# Altium project Cats_and_Dogs_Schematics_ESE516.PrjPcb (part 2 of 3)

## Sheet MCU.SchDoc: Smart Street Light System - MCU Schematic Doc
size 431 x 279 mm; Author: Arvind Balaji Narayan, Gopik Anand; Engineer: Arvind Balaji Narayan, Gopik Anand; Organization: University of Pennsylvania
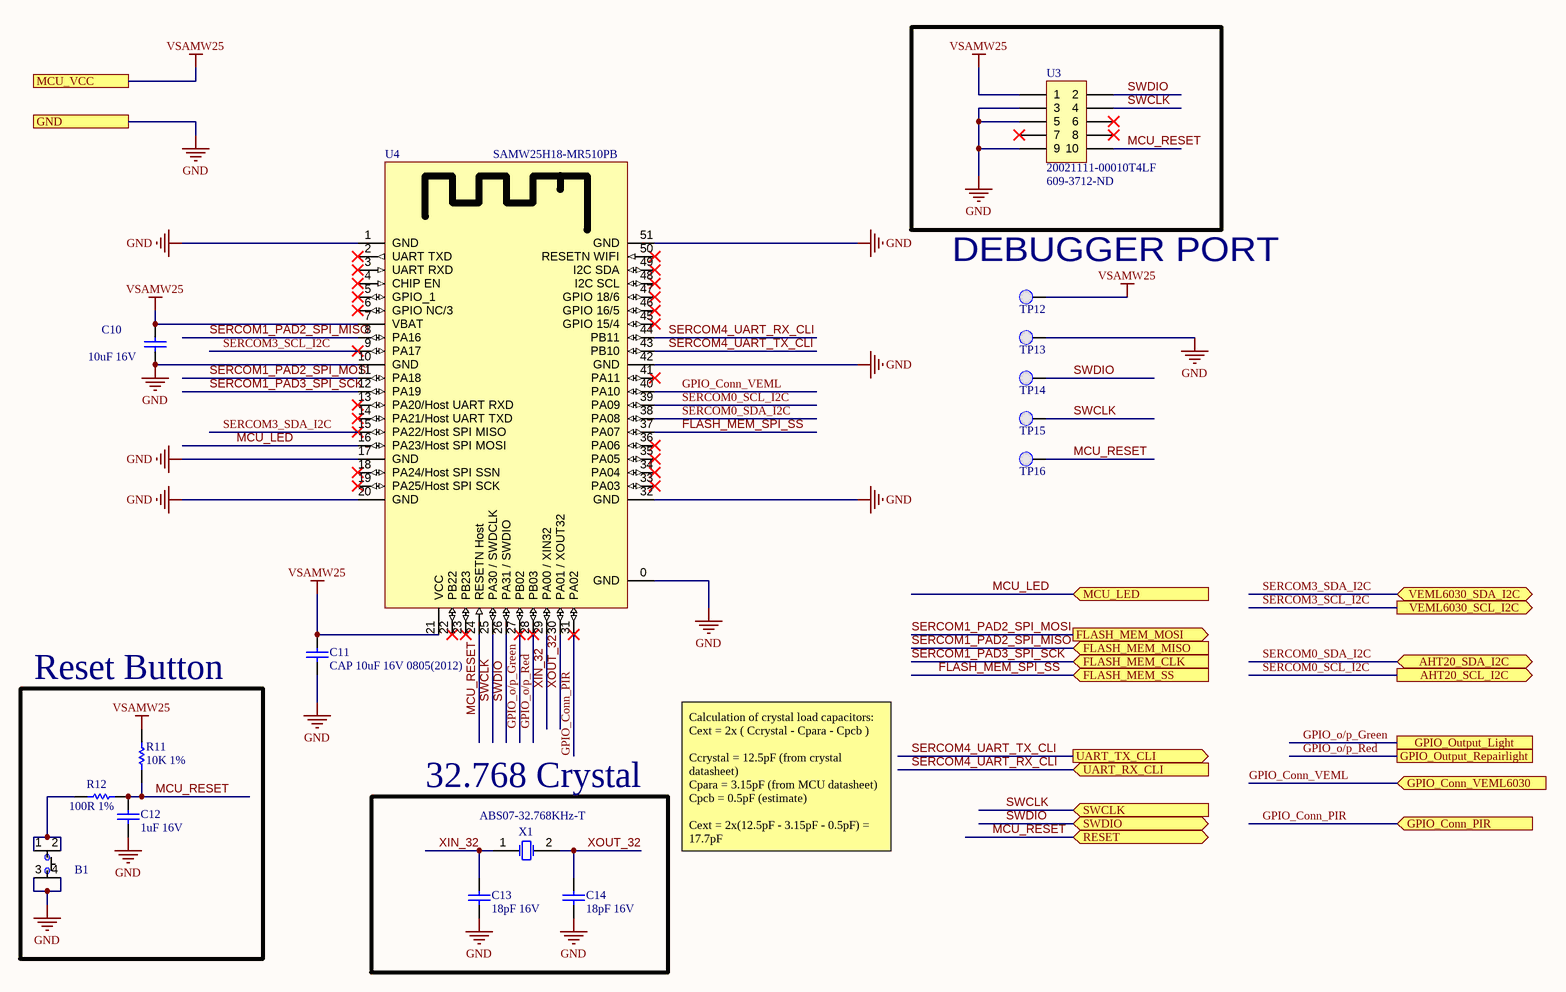
[diagram p5: MCU.SchDoc]

### Parts
B1  PTS810 SJK 250 SMTR LFS  [PTS810 SJK 250 SMTR LFS]  (value not drawn)
C10  10uF 16V  [CAPC0805(2012)145_N]
C11  CAP 10uF 16V 0805(2012)  [CAPC0805(2012)145_N]
C12  1uF 16V  [CAPC0603(1608)100_N]
C13  18pF 16V  [CAPC0603(1608)100_N]
C14  18pF 16V  [CAPC0603(1608)100_N]
R11  10K 1%  [RESC0603(1608)_N]
R12  100R 1%  [RESC0603(1608)_N]
TP12  0.1" Pad  [PCBComponent]  (value not drawn)  (no BOM)
TP13  0.1" Pad  [PCBComponent]  (value not drawn)  (no BOM)
TP14  0.1" Pad  [PCBComponent]  (value not drawn)  (no BOM)
TP15  0.1" Pad  [PCBComponent]  (value not drawn)  (no BOM)
TP16  0.1" Pad  [PCBComponent]  (value not drawn)  (no BOM)
U3  20021111-00010T4LF  Supplier Part Number 1: 609-3712-ND  [20021111-00010T4LF]
U4  SAMW25H18-MR510PB  [SAMW25H18-MR510PB]
X1  ABS07-32.768KHz-T  [ABRA-ABS07-2_V]

### Blocks framed on the sheet
Reset Button: B1 C12 R11 R12
32.768 Crystal: C13 C14 X1

### Ports
AHT20_SCL_I2C (out), AHT20_SDA_I2C (bidir), FLASH_MEM_CLK (in), FLASH_MEM_MISO (in), FLASH_MEM_MOSI (out), FLASH_MEM_SS (in), GND, GPIO_Conn_PIR (in), GPIO_Conn_VEML6030 (in), GPIO_Output_Light, GPIO_Output_Repairlight, MCU_LED (in), MCU_VCC, RESET (bidir), SWCLK (in), SWDIO (bidir), UART_RX_CLI (in), UART_TX_CLI (out), VEML6030_SCL_I2C (out), VEML6030_SDA_I2C (bidir)

### Nets
GND: B1.3 B1.4 C10.1 C11.1 C12.1 C13.1 C14.1 TP13.1(PAD) U3.3 U3.5 U3.9 U4.0(GND) U4.1(GND) U4.10(GND) U4.17(GND) U4.20(GND) U4.32(GND) U4.42(GND) U4.51(GND) ; port GND
VSAMW25: C10.2 C11.2 R11.2 TP12.1(PAD) U3.1 U4.7(VBAT) U4.21(VCC) ; port MCU_VCC  [project net 3.3V]
FLASH_MEM_SPI_SS: U4.37(PA07) ; port FLASH_MEM_SS
GPIO_Conn_PIR: U4.31(PA02) ; port GPIO_Conn_PIR
GPIO_Conn_VEML: U4.40(PA10) ; port GPIO_Conn_VEML6030  [project net GPIO_Conn_MCU]
GPIO_o/p_Green: U4.27(PB02) ; port GPIO_Output_Light
GPIO_o/p_Red: U4.28(PB03) ; port GPIO_Output_Repairlight
MCU_LED: U4.16(PA23/Host_SPI_MOSI) ; port MCU_LED
MCU_RESET: C12.2 R11.1 R12.2 TP16.1(PAD) U3.10 U4.24(RESETN_Host) ; port RESET
SERCOM0_SCL_I2C: U4.39(PA09) ; port AHT20_SCL_I2C  [project net SCL_AHT20]
SERCOM0_SDA_I2C: U4.38(PA08) ; port AHT20_SDA_I2C  [project net SDA_AHT20]
SERCOM1_PAD2_SPI_MISO: U4.8(PA16) ; port FLASH_MEM_MISO
SERCOM1_PAD2_SPI_MOSI: U4.11(PA18) ; port FLASH_MEM_MOSI
SERCOM1_PAD3_SPI_SCK: U4.12(PA19) ; port FLASH_MEM_CLK
SERCOM3_SCL_I2C: U4.9(PA17) ; port VEML6030_SCL_I2C  [project net SCL_VEML6030]
SERCOM3_SDA_I2C: U4.15(PA22/Host_SPI_MISO) ; port VEML6030_SDA_I2C  [project net SDA_VEML6030]
SERCOM4_UART_RX_CLI: U4.44(PB11) ; port UART_RX_CLI  [project net MCU_RX_UART_CLI]
SERCOM4_UART_TX_CLI: U4.43(PB10) ; port UART_TX_CLI  [project net MCU_TX_UART_CLI]
SWCLK: TP15.1(PAD) U3.4 U4.25(PA30_/_SWDCLK) ; port SWCLK
SWDIO: TP14.1(PAD) U3.2 U4.26(PA31_/_SWDIO) ; port SWDIO
XIN_32: C13.2 U4.29(PA00_/_XIN32) X1.1(X1)
XOUT_32: C14.2 U4.30(PA01_/_XOUT32) X1.2(X2)
NetB1_1: B1.1 B1.2 R12.1

Not connected (* = marked no-connect by the designer): U3 6* 7* 8*; U4 2(UART_TXD)* 3(UART_RXD)* 4(CHIP_EN)* 5(GPIO_1)* 6(GPIO_NC/3)* 13(PA20/Host_UART_RXD)* 14(PA21/Host_UART_TXD)* 18(PA24/Host_SPI_SSN)* 19(PA25/Host_SPI_SCK)* 22(PB22)* 23(PB23)* 33(PA03)* 34(PA04)* 35(PA05)* 36(PA06)* 41(PA11)* 45(GPIO_15/4)* 46(GPIO_16/5)* 47(GPIO_18/6)* 48(I2C_SCL)* 49(I2C_SDA)* 50(RESETN_WIFI)*

### Notes on the sheet
- (near TP12) DEBUGGER PORT
- Calculation of crystal load capacitors:
  Cext = 2x ( Ccrystal - Cpara - Cpcb )
  Ccrystal = 12.5pF (from crystal datasheet)
  Cpara = 3.15pF (from MCU datasheet)
  Cpcb = 0.5pF (estimate)
  Cext = 2x(12.5pF - 3.15pF - 0.5pF) = 17.7pF
- DWG. NO.
- REV.
- SHT.
- THIS DOCUMENT AND THE DATA DISCLOSED HEREIN OR HEREWITH IS THE PROPERTY OF ALTIUM LIMITED AND MAY BE FREELY DISTRIBUTED IN WHOLE. NO RIGHTS ARE RESERVED OR EXPRESS OR IMPLIED WARANTEE GIVEN.
- REVISION
- DESCRIPTION
- DATE
- APPROVED
- ENG:
- APPROVALS
- PROJECT
- DSN:
- CHK:
- REFERENCE DOCUMENTS
- PROJECT REVISION:
- TITLE
- DOCUMENT REVISION:
- DESIGN ITEM:
- BOM:
- FAB DWG:
- PCB DWG:
- ASSY DWG:
- SCALE:
- SIZE
- B
- CAGE CODE
- FILE NAME
- DWG NO.
- SHEET
- OF
- REV

### Library data of the parts
B1 = PTS810 SJK 250 SMTR LFS: SWITCH TACTILE SPST-NO 0.05A 16V Tactile Switch SPST-NO Top Actuated Surface Mount; Manufacturer: ITT /  C&K Components; Part # Aliases: Y97LT25B5DBFP; Operating Force: 2.6 N; Actuator: Oval; Current Rating: 50 mA; Voltage Rating DC: 16 VDC; Contact Form: SPST; Switch Function: OFF - (ON); Mounting Direction: Straight; Stem Height: 2.5 mm; Brand: C&K Components; Travel: 0.15 mm; Manufacturer Part Number: PTS810SJK250SMTRLFS; Product Category: Tactile Switches; RoHS: Details; Termination Style: J Form Lead; Mounting Style: SMD/SMT; Color: White; Packaging: Reel; Contact Plating: Silver; Operating Temperature Range: - 40 C to + 85 C; Series: PTS810; Factory Pack Quantity: 2900; ComponentLink1URL: https://datasheet.ciiva.com/18514/pts810-4mar13-18514061.pdf; ComponentLink1Description: https://datasheet.ciiva.com/18514/pts810-4mar13-18514061.pdf; ComponentLink2URL: https://datasheet.ciiva.com/18514/pts810-4mar13-18514062.pdf; ComponentLink2Description: https://datasheet.ciiva.com/18514/pts810-4mar13-18514062.pdf; ComponentLink3URL: https://datasheet.ciiva.com/18514/pts810-4mar13-18514063.pdf; ComponentLink3Description: https://datasheet.ciiva.com/18514/pts810-4mar13-18514063.pdf; Supplier 1: Digi-Key; Supplier Part Number 1: CKN10503CT-ND
C10 C11 = CMP-1036-04927-1: CAP 10uF 16V ±10% 0805 (2012 Metric) Thickness 1.45mm SMD; Case-EIA: 0805; Tolerance: Â±10%; Case-Metric: 2012; Rated Voltage: 16 V; Technology: SMT; Value: 10uF; Max Thickness: 1.45 mm
C12 = CMP-1035-02736-1: CAP 1uF 16V ±5% 0603 (1608 Metric) Thickness 1mm SMD; Case-Metric: 1608; Case-EIA: 0603; Tolerance: Â±5%; Technology: SMT; Max Thickness: 1 mm; Rated Voltage: 16 V; Value: 1uF
C13 C14 = CMP-1035-00738-1: CAP 18pF 16V ±5% 0603 (1608 Metric) Thickness 1mm SMD; Tolerance: Â±5%; Case-EIA: 0603; Case-Metric: 1608; Max Thickness: 1 mm; Rated Voltage: 16 V; Value: 18pF; Technology: SMT
R11 = CMP-1012-00623-1: 10K 0.1W 1% 0603 (1608 Metric)  SMD; Value: 10000.00 Ohm; Case-EIA: 0603; Case-Metric: 1608; Power: 0.1 W; Tolerance: 1 %; Technology: SMT
R12 = CMP-1012-00397-1: 100R 0.1W 1% 0603 (1608 Metric)  SMD; Value: 100.00 Ohm; Case-EIA: 0603; Case-Metric: 1608; Technology: SMT; Tolerance: 1 %; Power: 0.1 W
TP12-TP16 = 0.1" Pad-A.4
U3 = 20021111-00010T4LF: CONN HEADER 10POS UNSHD VERT T/H; Manufacturer: Amphenol / FCI; Stack Height: 2.5 mm; Number of Positions / Contacts: 10; Brand: FCI; Pitch: 1.27 mm; Mounting Angle: Vertical; Current Rating: 10 A; Mating Post Length: 3.05 mm; Voltage Rating: 125 V; Manufacturer Part Number: 20021111-00010T4LF; Mounting Style: Through Hole; Product Category: Headers & Wire Housings; RoHS: Details; Series: Minitek; Product Type: Headers; Type: Unshrouded; Number of Positions: 10; Number of Rows: 2; Contact Plating: Gold; Housing Material: Plastic; Termination Style: Through Hole; Contact Material: Nickel; Packaging: Tube; Factory Pack Quantity: 93; Termination Post Length: 2.3 mm; ComponentLink1URL: https://datasheet.ciiva.com/1433/1079612-1433267.pdf; ComponentLink1Description: https://datasheet.ciiva.com/1433/1079612-1433267.pdf; ComponentLink2URL: https://datasheet.ciiva.com/409/20021111-409158.pdf; ComponentLink2Description: https://datasheet.ciiva.com/409/20021111-409158.pdf; ComponentLink3URL: https://datasheet.ciiva.com/5131/20021111-5131386.pdf; ComponentLink3Description: https://datasheet.ciiva.com/5131/20021111-5131386.pdf; ComponentLink4URL: https://datasheet.ciiva.com/9465/20021111-9465402.pdf; ComponentLink4Description: https://datasheet.ciiva.com/9465/20021111-9465402.pdf; Supplier 1: Digi-Key
U4 = SAMW25H18-MR510PB: RF TXRX MODULE WIFI TRACE ANT; Manufacturer: Atmel; Manufacturer Part Number: ATSAMW25H18-MR510PB; Protocol: 802.11b/g/n; Frequency: 2.4GHz; Data Rate: 65Mbps; Power - Output: 17dBm; Sensitivity: -95.5dBm; Serial Interfaces: SPI, UART; Antenna Type: Integrated, Trace; Memory Size: 256kB Flash, 32kB SRAM; Voltage - Supply: 2.7 V ~ 4.2 V; Category: RF/IF and RFID; Family: RF Transceiver Modules; Series: Xplained Pro; Packaging: Tray; RF Family/Standard: WiFi; Modulation: -; Current - Receiving: -; Current - Transmitting: -; Mounting Type: Surface Mount; Operating Temperature: -40°C ~ 85°C; Package / Case: Module; ComponentLink1URL: http://www.atmel.com/devices/ATSAMW25.aspx; ComponentLink1Description: http://www.atmel.com/devices/ATSAMW25.aspx; ComponentLink2URL: http://www.farnell.com/datasheets/1965115.pdf; ComponentLink2Description: http://www.farnell.com/datasheets/1965115.pdf; Supplier 1: Digikey; Stock 1: 120; Pricing 1: 1=19.14 (USD); Supplier Part Number 1: ATSAMW25H18-MR510PB-ND
X1 = CMP-0447-00001-2: Crystal, 32.768 kHz, 12.5 pF, -40 to 85 degC, SMD Low Profile 3.2 x 1.5 x 0.9 mm, Tape and Reel; Manufacturer: Abracon; Q Value (Type): 30000; Operation Mode: Flexural Mode (Tuning Fork); Shunt Capacitance (C0): 0.9 to 1.2 pF; Load Capacitance (CL): 12.5 pF; Frequency Tolerance @+25degC: +/- 20 ppm; Drive Level (Type): 0.1 uW; Equivalent Series Resistance (R1): 70 Kohm; Insulation Resistance (Min): 500 Mohm; ComponentLink3URL: http://www.abracon.com/Resonators/ABS07.pdf; PackageDescription: 2-Pin Hand Drawn, Body 3.2x1.5mm, Pitch 2.5mm; Operating Temperature: -40 to 85 degC; ComponentLink2URL: http://www.abracon.com/Resonators/ABS07.pdf; PackageReference: ABS07-2; ComponentLink3Description: Package Specification; ComponentLink1Description: Manufacturer URL; DatasheetVersion: 04.03.13; Mounting Technology: Surface Mount; ComponentLink2Description: Datasheet; ComponentLink1URL: http://www.abracon.com/; PartNumber: ABS07-32.768KHz-T; Packing: Tape and Reel; Frequency: 32.768 kHz

## Sheet Sensors_StreetLight.SchDoc: Smart Street Light System - Street Light Schematic Doc
size 431 x 279 mm; Author: Arvind Balaji Narayan, Gopik Anand; CompanyName: Cats_and_Dogs; Engineer: Arvind Balaji Narayan, Gopik Anand; Organization: University of Pennsylvania
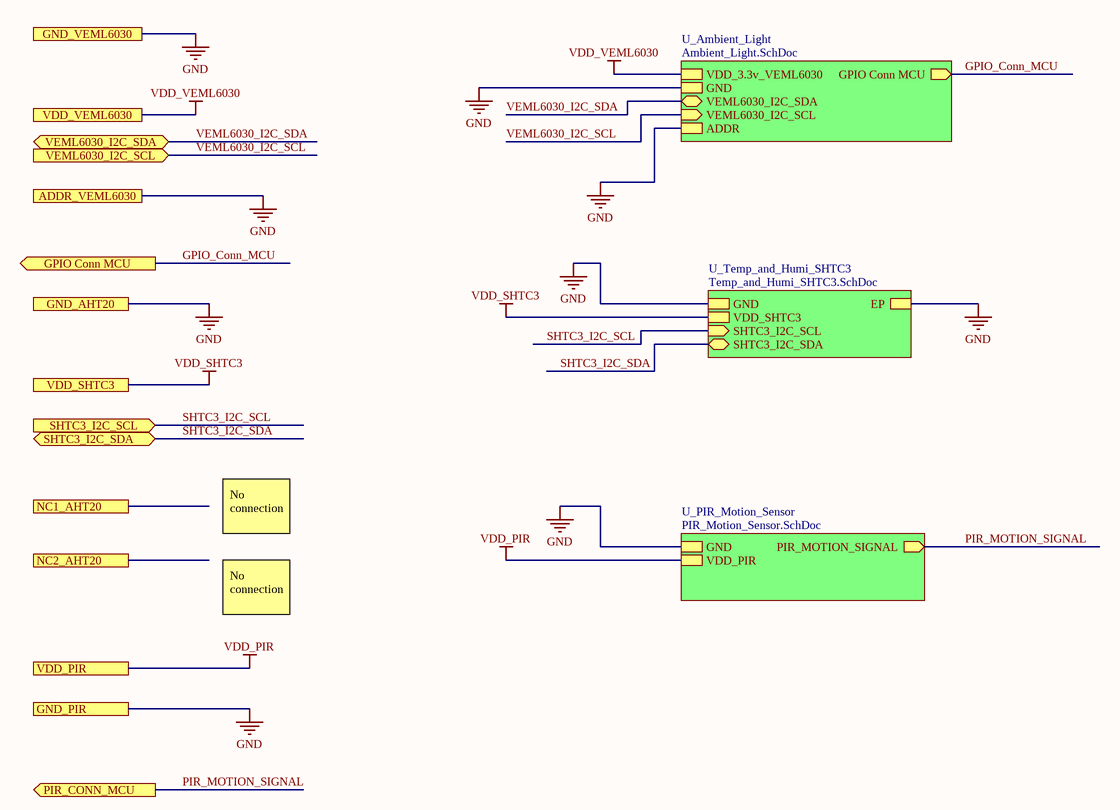
[diagram p6: Sensors_StreetLight.SchDoc]

### Sub-sheets
U_Ambient_Light = Ambient_Light.SchDoc: VDD_3.3v_VEML6030, GND, VEML6030_I2C_SDA (bidir), VEML6030_I2C_SCL (in), ADDR, GPIO Conn MCU (out)
U_PIR_Motion_Sensor = PIR_Motion_Sensor.SchDoc: GND, VDD_PIR, PIR_MOTION_SIGNAL (out)
U_Temp_and_Humi_SHTC3 = Temp_and_Humi_SHTC3.SchDoc: GND, VDD_SHTC3, SHTC3_I2C_SCL (in), SHTC3_I2C_SDA (bidir), EP

### Ports
ADDR_VEML6030, GND_AHT20, GND_PIR, GND_VEML6030, GPIO Conn MCU (out), NC1_AHT20, NC2_AHT20, PIR_CONN_MCU (out), SHTC3_I2C_SCL (in), SHTC3_I2C_SDA (bidir), VDD_PIR, VDD_SHTC3, VDD_VEML6030, VEML6030_I2C_SCL (in), VEML6030_I2C_SDA (bidir)

### Nets
GND: port ADDR_VEML6030, port GND_AHT20, port GND_VEML6030, port GND_PIR, sheet U_Ambient_Light/GND, sheet U_Ambient_Light/ADDR, sheet U_PIR_Motion_Sensor/GND, sheet U_Temp_and_Humi_SHTC3/GND, sheet U_Temp_and_Humi_SHTC3/EP
VDD_PIR: port VDD_PIR, sheet U_PIR_Motion_Sensor/VDD_PIR  [project net 12V]
VDD_SHTC3: port VDD_SHTC3, port VDD_VEML6030, sheet U_Ambient_Light/VDD_3.3v_VEML6030, sheet U_Temp_and_Humi_SHTC3/VDD_SHTC3  [also labelled VDD_VEML6030]  [project net 3.3V]
GPIO_Conn_MCU: port GPIO Conn MCU, sheet U_Ambient_Light/GPIO Conn MCU
PIR_MOTION_SIGNAL: port PIR_CONN_MCU, sheet U_PIR_Motion_Sensor/PIR_MOTION_SIGNAL  [project net GPIO_Conn_PIR]
SHTC3_I2C_SCL: port SHTC3_I2C_SCL, sheet U_Temp_and_Humi_SHTC3/SHTC3_I2C_SCL  [project net SCL_AHT20]
SHTC3_I2C_SDA: port SHTC3_I2C_SDA, sheet U_Temp_and_Humi_SHTC3/SHTC3_I2C_SDA  [project net SDA_AHT20]
VEML6030_I2C_SCL: port VEML6030_I2C_SCL, sheet U_Ambient_Light/VEML6030_I2C_SCL  [project net SCL_VEML6030]
VEML6030_I2C_SDA: port VEML6030_I2C_SDA, sheet U_Ambient_Light/VEML6030_I2C_SDA  [project net SDA_VEML6030]

### Notes on the sheet
- No connection
- DWG. NO.
- REV.
- SHT.
- THIS DOCUMENT AND THE DATA DISCLOSED HEREIN OR HEREWITH IS THE PROPERTY OF ALTIUM LIMITED AND MAY BE FREELY DISTRIBUTED IN WHOLE. NO RIGHTS ARE RESERVED OR EXPRESS OR IMPLIED WARANTEE GIVEN.
- REVISION
- DESCRIPTION
- DATE
- APPROVED
- ENG:
- APPROVALS
- PROJECT
- DSN:
- CHK:
- REFERENCE DOCUMENTS
- PROJECT REVISION:
- TITLE
- DOCUMENT REVISION:
- DESIGN ITEM:
- BOM:
- FAB DWG:
- PCB DWG:
- ASSY DWG:
- SCALE:
- SIZE
- B
- CAGE CODE
- FILE NAME
- DWG NO.
- SHEET
- OF
- REV

## Sheet Ambient_Light.SchDoc: Smart Street Light System - Light Sensor Schematic Doc
size 431 x 279 mm; Author: Arvind Balaji Narayan, Gopik Anand; CompanyName: Cats_and_Dogs; Engineer: Arvind Balaji Narayan, Gopik Anand; Organization: University of Pennsylvania
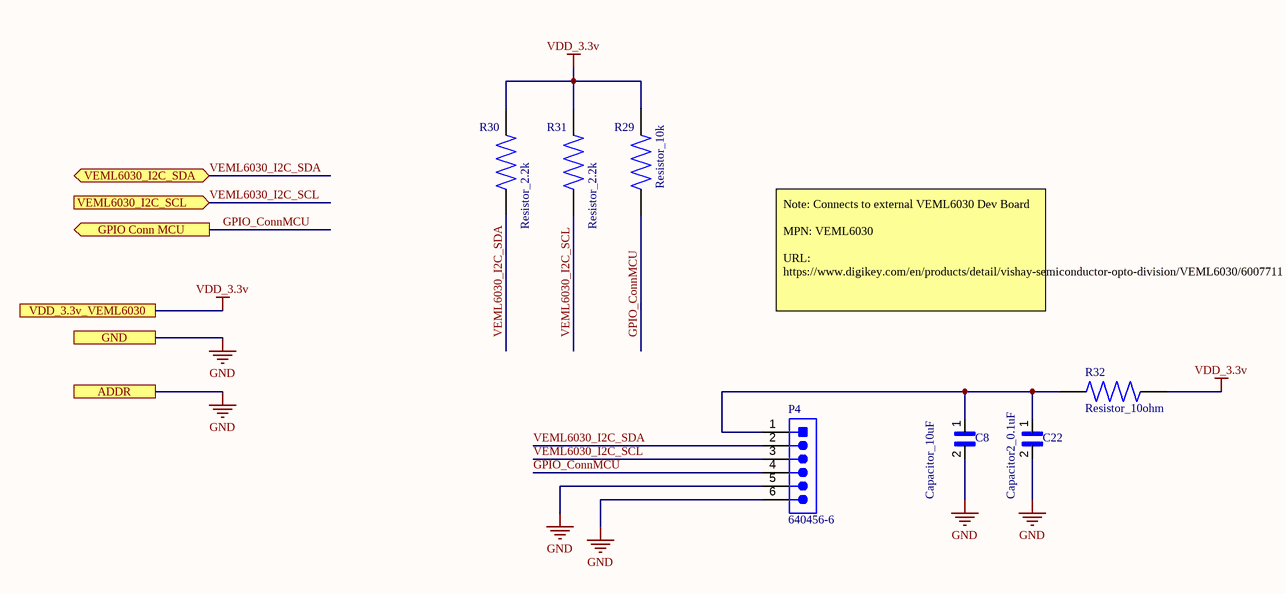
[diagram p7: Ambient_Light.SchDoc]

### Parts
C8  Capacitor_10uF  [Capacitor_10uF]
C22  Capacitor2_0.1uF  [Capacitor2_0.1uF]
P4  640456-6  [TECO-640456-6_V]
R29  Resistor_10k  [Resistor_10k]
R30  Resistor_2.2k  [Resistor_2.2k]
R31  Resistor_2.2k  [Resistor_2.2k]
R32  Resistor_10ohm  [Resistor_10ohm]

### Ports
ADDR, GND, GPIO Conn MCU (out), VDD_3.3v_VEML6030, VEML6030_I2C_SCL (in), VEML6030_I2C_SDA (bidir)

### Nets
GND: C8.2 C22.2 P4.5 P4.6 ; port GND, port ADDR
VDD_3.3v: R29.2 R30.2 R31.2 R32.2 ; port VDD_3.3v_VEML6030  [project net 3.3V]
GPIO_ConnMCU: P4.4 R29.1 ; port GPIO Conn MCU  [project net GPIO_Conn_MCU]
VEML6030_I2C_SCL: P4.3 R31.1 ; port VEML6030_I2C_SCL  [project net SCL_VEML6030]
VEML6030_I2C_SDA: P4.2 R30.1 ; port VEML6030_I2C_SDA  [project net SDA_VEML6030]
NetC8_1: C8.1 C22.1 P4.1 R32.1

### Notes on the sheet
- Note: Connects to external VEML6030 Dev Board
  MPN: VEML6030
  URL: https://www.digikey.com/en/products/detail/vishay-semiconductor-opto-division/VEML6030/6007711
- DWG. NO.
- REV.
- SHT.
- THIS DOCUMENT AND THE DATA DISCLOSED HEREIN OR HEREWITH IS THE PROPERTY OF ALTIUM LIMITED AND MAY BE FREELY DISTRIBUTED IN WHOLE. NO RIGHTS ARE RESERVED OR EXPRESS OR IMPLIED WARANTEE GIVEN.
- REVISION
- DESCRIPTION
- DATE
- APPROVED
- ENG:
- APPROVALS
- PROJECT
- DSN:
- CHK:
- REFERENCE DOCUMENTS
- PROJECT REVISION:
- TITLE
- DOCUMENT REVISION:
- DESIGN ITEM:
- BOM:
- FAB DWG:
- PCB DWG:
- ASSY DWG:
- SCALE:
- SIZE
- B
- CAGE CODE
- FILE NAME
- DWG NO.
- SHEET
- OF
- REV

### Library data of the parts
C8 = Capacitor_10uF: 0805 35 V 10 uF ±10% Tolerance X5R Multilayer Ceramic Capacitor
C22 = Capacitor2_0.1uF: Cap Ceramic 0.1uF 16V X5R 10% SMD 0402 85°C Paper T/R; Manufacturer: KEMET; Manufacturer Part Number: C0402C104K4PACTU; Capacitance: 100nF; Dissipation Factor: 5%; Supplier 1: Digi-Key; Supplier Part Number 1: 399-C0402C104K4PAC7867TR-ND; RoHS: Yes; Category: Ceramic Capacitors; Stock 1: 2168149; Pricing 1: 10000=0.00873, 20000=0.00832 (USD); Mount: Surface Mount; Case/Package: 0402; Case Code (Metric): 1005; Case Code (Imperial): 0402; Contact Plating: Tin,Matte; Dielectric Material: Ceramic; Min Operating Temperature: -55°C; Max Operating Temperature: 85°C; Tolerance: 10%; Packaging: Tape and Reel; Voltage Rating: 16V; Package Quantity: 1; Voltage Rating (DC): 16V; Dielectric: X5R; Termination: SMD/SMT; Series: C; Construction: Flat; Length: 1mm; Width: 0.02inch; Height: 0.5mm; Thickness: 0.022inch; Depth: 0.5mm; Radiation Hardening: No; REACH SVHC: No SVHC; Lead Free: Lead Free; RoHS Compliant: Yes; ComponentLink1URL: https://datasheet.ciiva.com/26938/getdatasheetpartid-161478-26938210.pdf?src-supplier=Verical; ComponentLink1Description: https://datasheet.ciiva.com/26938/getdatasheetpartid-161478-26938210.pdf?src-supplier=Verical
P4 = CMP-2000-05661-1: Male Header, Pitch 2.54 mm, 1 x 6 Position, Height 10.03 mm, Tail Length 3.56 mm, -55 to 105 degC, Bulk; Manufacturer: TE Connectivity; Contact Centerline Spacing: 0.100 / in.; Number of Contacts: 6; Current, Rating: 5 / A; Agency Approvals: CSA,UL; Material, Contact: CopperAlloy; Mounting Hole Size: 0.04 / "; Brand/Series: MTA-100Series; Pin Spacing: 0.1 / "; Mount Angle: Vertical; Contact Termination Area Plating: Tin; Angle: Straight; Primary Type: InterconnectSystem; Standards: RoHSCompliant,ELVCompliant,UL94V-0; Temperature, Operating: -55to+105 / °C; Material, Housing: Polyester; Special Features: Pinstrip; Color, Housing: White; Connector Type: MTA-100; Voltage, Rating: 250 / V; Termination: Solder; Package Reference: 640456-6; Size, Post: 0.025 / in.; Color: White; Datasheet URL: https://datasheet.ciiva.com/25618/0900766b80eb7fdd-25618163.pdf; Manufacturer URL: http://www.te.com/; Mounting Type: PCMount; Length, Pin: 0.14 / "; Type: PCBPlug; Length, Overall: 0.6 / "; Mounting Technology: ThroughHole; Number of Rows: 1; Contact Shape: Square; Contact Mating Area Plating: Tin; Datasheet Version: Rev. W, 05/2005; Number of Positions: 6; Package Description: Male Header, Pitch 2.54 mm, 1 x 6 Position, Height 10.03 mm, Tail Length 3.56 mm; Contact Plating: Tin; Length, Terminal Post: 0.14 / in.; Flammability Rating: UL94V-0
R29 = Resistor_10k: Res Thin Film 0805 10K Ohm 1% 1/10W ±50ppm/°C Molded SMD SMD Paper T/R; Manufacturer: TE Connectivity Neohm; Manufacturer Part Number: CPF0805F10KC1; Resistance: 10kR; Max Power Dissipation: 100mW; Number of Resistors: 1; Voltage Rating: 100V; Supplier 1: Mouser; Supplier Part Number 1: 279-CPF0805F10KC1; RoHS: Yes; Category: Chip SMD Resistors; Stock 1: 2893; Pricing 1: 1=0.12000, 10=0.10000, 50=0.10000, 100=0.05400, 1000=0.02200, 10000=0.02200 (USD); Mount: Surface Mount; Case/Package: 0805; Min Operating Temperature: -55°C; Max Operating Temperature: 155°C; Packaging: Tape and Reel; Number of Terminations: 2; Temperature Coefficient: 50ppm/°C; Tolerance: 1%; Series: CPF, Neohm; Power Rating: 100mW; Termination: Solder; RoHS Compliant: Yes; ELV: Compliant; ComponentLink1URL: https://www.te.com/commerce/DocumentDelivery/DDEController?Action=srchrtrv&amp;DocNm=1773200&amp;DocType=DS&amp;DocLang=English&src-supplier=Digi-Key; ComponentLink1Description: https://www.te.com/commerce/DocumentDelivery/DDEController?Action=srchrtrv&amp;DocNm=1773200&amp;DocType=DS&amp;DocLang=English&src-supplier=Digi-Key
R30 R31 = Resistor_2.2k: Res Thick Film 0805 2.2K Ohm 5% 1/3W ±100ppm/°C Molded SMD SMD T/R; Manufacturer: TE Connectivity Holsworthy; Manufacturer Part Number: CRGH0805J2K2; Resistance: 2.2kR; Power Rating: 330mW; Voltage Rating: 150V; Number of Resistors: 1; Supplier 1: Digi-Key; Supplier Part Number 1: A126438CT-ND; RoHS: Yes; Category: Chip SMD Resistors; Stock 1: 10746; Pricing 1: 1=0.10000, 10=0.07200, 100=0.02930, 1000=0.01317, 2500=0.01143 (USD); Mount: Surface Mount; Case/Package: 0805; Case Code (Imperial): 0805; Case Code (Metric): 2012; Min Operating Temperature: -55°C; Max Operating Temperature: 125°C; Tolerance: 5%; Packaging: Tape and Reel; Resistor Type: Thick Film,Power resistor; Temperature Coefficient: 100ppm/°C; Number of Terminations: 2; Series: CRGH; Termination: Solder; Voltage Rating (DC): 150V; Resistance Tolerance: 5%; Technology: THICK FILM; Length: 2mm; Width: 1.25mm; Height: 0.55mm; Depth: 1.25mm; RoHS Compliant: Yes; REACH SVHC: No SVHC; ELV: Compliant; ComponentLink1URL: https://datasheet.ciiva.com/12564/ng-ds-1773204-g-213532-12564996.pdf?src-supplier=Mouser; ComponentLink1Description: https://datasheet.ciiva.com/12564/ng-ds-1773204-g-213532-12564996.pdf?src-supplier=Mouser; ComponentLink2URL: https://datasheet.ciiva.com/22670/1755795-22670438.pdf?src-supplier=Element14; ComponentLink2Description: https://datasheet.ciiva.com/22670/1755795-22670438.pdf?src-supplier=Element14
R32 = Resistor_10ohm: RES TF 1/10W 10 OHM 1% 0603; Manufacturer: Yageo; Manufacturer Part Number: RT0603DRE0710RL; Resistance: 10R; Tolerance: 0.5%; Temperature Coefficient: 50ppm/°C; Max Power Dissipation: 100mW; Voltage Rating (DC): 50V; Supplier 1: Mouser; Supplier Part Number 1: 603-RT0603DRE0710RL; RoHS: Yes; Category: Chip SMD Resistors; Stock 1: 9956; Pricing 1: 1=0.16000, 10=0.10500, 50=0.10500, 100=0.04100, 1000=0.02100, 10000=0.01300 (USD); Case/Package: 0603; Contact Plating: Tin,Matte; Case Code (Metric): 1608; Case Code (Imperial): 0603; Min Operating Temperature: -55°C; Max Operating Temperature: 155°C; Resistor Type: Thin Film; Package Quantity: 5000; Packaging: Tape and Reel; Number of Terminations: 2; Features: Moisture Resistant; Series: RT; Length: 0.063inch; Width: 0.031inch; Height: 0.022inch; Radiation Hardening: No; RoHS Compliant: Yes; Lead Free: Lead Free; ComponentLink1URL: https://datasheet.ciiva.com/8891/pyu-rt-1-to-0-05-rohs-l-4-8891368.pdf?src-supplier=Avnet; ComponentLink1Description: https://datasheet.ciiva.com/8891/pyu-rt-1-to-0-05-rohs-l-4-8891368.pdf?src-supplier=Avnet; ComponentLink2URL: https://datasheet.ciiva.com/2565/pyu-rt-1-to-0-05-rohs-l-5-2565943.pdf?src-supplier=Digi-Key; ComponentLink2Description: https://datasheet.ciiva.com/2565/pyu-rt-1-to-0-05-rohs-l-5-2565943.pdf?src-supplier=Digi-Key; Supplier 2: Digi-Key; Supplier Part Number 2: RMCF0603FT10R0TR-ND; Stock 2: 6764342; Pricing 2: 5000=0.00218 (USD); Mount: Surface Mount; Power Rating: 100mW; Construction: Rectangular; Depth: 0.8mm; Military Standard: Not; ComponentLink3URL: http://components.arrow.com/part/dataview/44988319S6756893N1174?src-supplier=Arrow+Electronics; ComponentLink3Description: http://components.arrow.com/part/dataview/44988319S6756893N1174?src-supplier=Arrow+Electronics; ComponentLink4URL: https://www.seielect.com/catalog/SEI-Packaging.pdf?src-supplier=Digi-Key; ComponentLink4Description: https://www.seielect.com/catalog/SEI-Packaging.pdf?src-supplier=Digi-Key; ComponentLink5URL: https://www.seielect.com/catalog/SEI-RMCF_RMCP.pdf?src-supplier=Avnet; ComponentLink5Description: https://www.seielect.com/catalog/SEI-RMCF_RMCP.pdf?src-supplier=Avnet; ComponentLink6URL: https://www.seielect.com/catalog/SEI-RMCF_RMCP.pdf?src-supplier=Avnet+Asia; ComponentLink6Description: https://www.seielect.com/catalog/SEI-RMCF_RMCP.pdf?src-supplier=Avnet+Asia; ComponentLink7URL: https://www.verical.com/server-webapp/html/getDatasheet?partID=372827&src-supplier=Verical; ComponentLink7Description: https://www.verical.com/server-webapp/html/getDatasheet?partID=372827&src-supplier=Verical

## Sheet PIR_Motion_Sensor.SchDoc: Smart Street Light System - PIR Schematic Doc
size 431 x 279 mm; Author: Arvind Balaji Narayan, Gopik Anand; CompanyName: Cats_and_Dogs; Engineer: Arvind Balaji Narayan, Gopik Anand; Organization: University of Pennsylvania
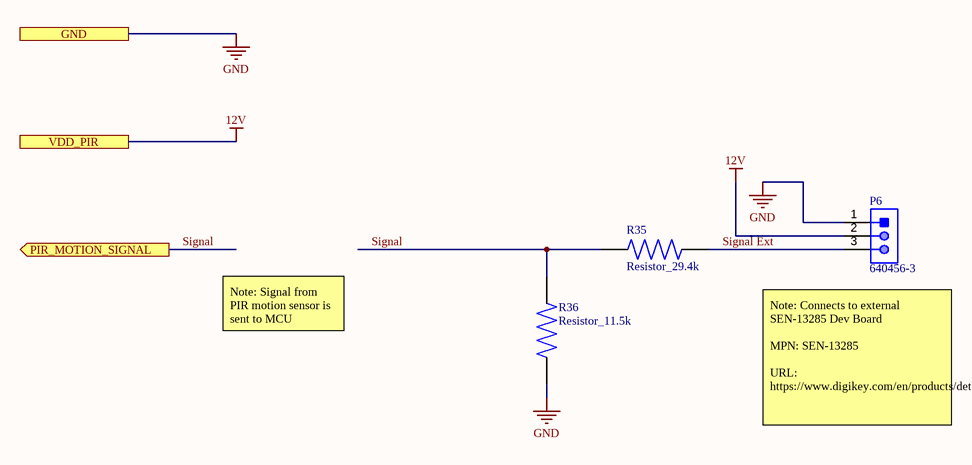
[diagram p8: PIR_Motion_Sensor.SchDoc]

### Parts
P6  640456-3  [TECO-640456-3]
R35  Resistor_29.4k  [Resistor_29.4k]
R36  Resistor_11.5k  [Resistor_11.5k]

### Ports
GND, PIR_MOTION_SIGNAL (out), VDD_PIR

### Nets
12V: P6.2 ; port VDD_PIR
GND: P6.1 R36.1 ; port GND
Signal: R35.1 R36.2 ; port PIR_MOTION_SIGNAL  [project net GPIO_Conn_PIR]
Signal Ext: P6.3 R35.2

### Notes on the sheet
- Note: Signal from PIR motion sensor is sent to MCU
- (near P6) Note: Connects to external SEN-13285 Dev Board
  MPN: SEN-13285
  URL: https://www.digikey.com/en/products/detail/sparkfun-electronics/SEN-13285/5673793?s=N4IgTCBcDaIM4FMB2BGAzGAHAVhAXQF8g
- DWG. NO.
- REV.
- SHT.
- THIS DOCUMENT AND THE DATA DISCLOSED HEREIN OR HEREWITH IS THE PROPERTY OF ALTIUM LIMITED AND MAY BE FREELY DISTRIBUTED IN WHOLE. NO RIGHTS ARE RESERVED OR EXPRESS OR IMPLIED WARANTEE GIVEN.
- REVISION
- DESCRIPTION
- DATE
- APPROVED
- ENG:
- APPROVALS
- PROJECT
- DSN:
- CHK:
- REFERENCE DOCUMENTS
- PROJECT REVISION:
- TITLE
- DOCUMENT REVISION:
- DESIGN ITEM:
- BOM:
- FAB DWG:
- PCB DWG:
- ASSY DWG:
- SCALE:
- SIZE
- B
- CAGE CODE
- FILE NAME
- DWG NO.
- SHEET
- OF
- REV

### Library data of the parts
P6 = CMP-2000-05418-1: Male Header, Pitch 2.54 mm, 1 x 3 Position, Height 10.03 mm, Tail Length 3.56 mm, -55 to 105 degC; Manufacturer: TE Connectivity; Agency Approvals: CSA,UL; Angle: Straight; Number of Positions: 3; Standards: RoHSCompliant,ELVCompliant,UL94V-0; Current, Rating: 5 / A; Connector Type: MTA-100; Mount Angle: Vertical; Material, Housing: Polyester; Temperature, Operating: -55to+105 / degC; Voltage, Rating: 250 / V; Color, Housing: White; Contact Centerline Spacing: 0.100 / in.; Special Features: Pinstrip; Material, Contact: CopperAlloy; Contact Termination Area Plating: Tin; Primary Type: InterconnectSystem; Pin Spacing: 0.1 / "; Brand/Series: MTA-100Series; Mounting Hole Size: 0.04 / "; Manufacturer URL: http://www.te.com/; Datasheet URL: https://datasheet.ciiva.com/16456/eng-ds-82056-mta-0608-16456886.pdf; Flammability Rating: UL94V-0; Mounting Type: PCMount; Contact Mating Area Plating: Tin; Datasheet Version: Jun-08; Number of Rows: 1; Termination: Solder; Type: PCBPlug; Length, Pin: 0.14 / "; Color: White; Contact Plating: Tin; Contact Shape: Square; Number of Contacts: 3; Size, Post: 0.025 / in.; Length, Terminal Post: 0.14 / in.; Length, Overall: 0.3 / "
R35 = Resistor_29.4k: Res Thick Film 0402 29.4K Ohm 1% 0.063W ±100ppm/°C Molded SMD Paper T/R; Manufacturer: KOA Speer; Manufacturer Part Number: RN73R2ATTD2942F50; Resistance: 29.4kR; Max Power Dissipation: 63mW; Supplier 1: Digi-Key; Supplier Part Number 1: 2019-RN73R2ATTD2942F50CT-ND; RoHS: Yes; Category: Chip SMD Resistors; Pricing 1: 1000=0.06962 (USD); Supplier 2: Digi-Key; Supplier Part Number 2: RMCF0402FT29K4CT-ND; Stock 2: 88848; Pricing 2: 1=0.10000, 10=0.01500, 100=0.00610, 1000=0.00274, 2500=0.00238, 5000=0.00197 (USD); Mount: Surface Mount; Case/Package: 0402; Case Code (Metric): 1005; Case Code (Imperial): 0402; Contact Plating: Tin,Matte; Min Operating Temperature: -55°C; Max Operating Temperature: 155°C; Packaging: Tape and Reel; Tolerance: 1%; Resistor Type: Thick Film; Number of Terminations: 2; Temperature Coefficient: 100ppm/°C; Features: Automotive AEC-Q200; Series: RMCF; Length: 0.039inch; Width: 0.02inch; Height: 0.016inch; Radiation Hardening: No; Lead Free: Lead Free; RoHS Compliant: Yes; ComponentLink1URL: https://www.seielect.com/Catalog/SEI-RMCF_RMCP.pdf?src-supplier=Digi-Key; ComponentLink1Description: https://www.seielect.com/Catalog/SEI-RMCF_RMCP.pdf?src-supplier=Digi-Key; ComponentLink2URL: https://www.seielect.com/catalog/SEI-RMCF_RMCP.pdf?src-supplier=Avnet; ComponentLink2Description: https://www.seielect.com/catalog/SEI-RMCF_RMCP.pdf?src-supplier=Avnet
R36 = Resistor_11.5k: Res 11.5K Ohm 0.5% 1/10W 0603; Manufacturer: KOA Speer; Manufacturer Part Number: RN73R1JTTD1152D100; Supplier 1: Digi-Key; Supplier Part Number 1: 2019-RN73R1JTTD1152D100CT-ND; RoHS: Yes; Category: Chip SMD Resistors; Pricing 1: 1000=0.05712 (USD)

## Sheet Temp_and_Humi_SHTC3.SchDoc: Smart Street Light System - Temp Sensor Schematic Doc
size 431 x 279 mm; Author: Arvind Balaji Narayan, Gopik Anand; CompanyName: Cats_and_Dogs; Engineer: Arvind Balaji Narayan, Gopik Anand; Organization: University of Pennsylvania
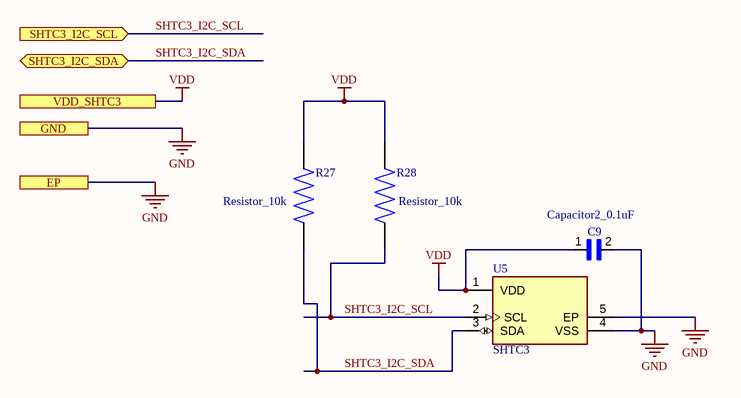
[diagram p9: Temp_and_Humi_SHTC3.SchDoc]

### Parts
C9  Capacitor2_0.1uF  [Capacitor2_0.1uF]
R27  Resistor_10k  [Resistor_10k]
R28  Resistor_10k  [Resistor_10k]
U5  SHTC3  [FP-SHTC3-MFG]

### Ports
EP, GND, SHTC3_I2C_SCL (in), SHTC3_I2C_SDA (bidir), VDD_SHTC3

### Nets
GND: C9.2 U5.4(VSS) U5.5(EP) ; port GND, port EP
VDD: C9.1 R27.2 R28.2 U5.1(VDD) ; port VDD_SHTC3  [project net 3.3V]
SHTC3_I2C_SCL: R28.1 U5.2(SCL) ; port SHTC3_I2C_SCL  [project net SCL_AHT20]
SHTC3_I2C_SDA: R27.1 U5.3(SDA) ; port SHTC3_I2C_SDA  [project net SDA_AHT20]

### Notes on the sheet
- DWG. NO.
- REV.
- SHT.
- THIS DOCUMENT AND THE DATA DISCLOSED HEREIN OR HEREWITH IS THE PROPERTY OF ALTIUM LIMITED AND MAY BE FREELY DISTRIBUTED IN WHOLE. NO RIGHTS ARE RESERVED OR EXPRESS OR IMPLIED WARANTEE GIVEN.
- REVISION
- DESCRIPTION
- DATE
- APPROVED
- ENG:
- APPROVALS
- PROJECT
- DSN:
- CHK:
- REFERENCE DOCUMENTS
- PROJECT REVISION:
- TITLE
- DOCUMENT REVISION:
- DESIGN ITEM:
- BOM:
- FAB DWG:
- PCB DWG:
- ASSY DWG:
- SCALE:
- SIZE
- B
- CAGE CODE
- FILE NAME
- DWG NO.
- SHEET
- OF
- REV

### Library data of the parts
C9 = Capacitor2_0.1uF: as C22 on sheet Ambient_Light; Supplier 1: Digi-Key; Supplier Part Number 1: 399-C0402C104K4PAC7867TR-ND; RoHS: Yes; Category: Ceramic Capacitors; Stock 1: 2168149; Pricing 1: 10000=0.00873, 20000=0.00832 (USD); Mount: Surface Mount; Case/Package: 0402; Case Code (Metric): 1005; Case Code (Imperial): 0402; Contact Plating: Tin,Matte; Dielectric Material: Ceramic; Min Operating Temperature: -55°C; Max Operating Temperature: 85°C; Tolerance: 10%; Packaging: Tape and Reel; Voltage Rating: 16V; Package Quantity: 1; Voltage Rating (DC): 16V; Dielectric: X5R; Termination: SMD/SMT; Series: C; Construction: Flat; Length: 1mm; Width: 0.02inch; Height: 0.5mm; Thickness: 0.022inch; Depth: 0.5mm; Radiation Hardening: No; REACH SVHC: No SVHC; Lead Free: Lead Free; RoHS Compliant: Yes; ComponentLink1URL: https://datasheet.ciiva.com/26938/getdatasheetpartid-161478-26938210.pdf?src-supplier=Verical; ComponentLink1Description: https://datasheet.ciiva.com/26938/getdatasheetpartid-161478-26938210.pdf?src-supplier=Verical
R27 R28 = Resistor_10k: as R29 on sheet Ambient_Light; Supplier 1: Mouser; Supplier Part Number 1: 279-CPF0805F10KC1; RoHS: Yes; Category: Chip SMD Resistors; Stock 1: 2893; Pricing 1: 1=0.12000, 10=0.10000, 50=0.10000, 100=0.05400, 1000=0.02200, 10000=0.02200 (USD); Mount: Surface Mount; Case/Package: 0805; Min Operating Temperature: -55°C; Max Operating Temperature: 155°C; Packaging: Tape and Reel; Number of Terminations: 2; Temperature Coefficient: 50ppm/°C; Tolerance: 1%; Series: CPF, Neohm; Power Rating: 100mW; Termination: Solder; RoHS Compliant: Yes; ELV: Compliant; ComponentLink1URL: https://www.te.com/commerce/DocumentDelivery/DDEController?Action=srchrtrv&amp;DocNm=1773200&amp;DocType=DS&amp;DocLang=English&src-supplier=Digi-Key; ComponentLink1Description: https://www.te.com/commerce/DocumentDelivery/DDEController?Action=srchrtrv&amp;DocNm=1773200&amp;DocType=DS&amp;DocLang=English&src-supplier=Digi-Key
U5 = CMP-144040-000003-1: SENSOR HUMI/TEMP I2C 2% SMD; Manufacturer: Sensirion; Operating Supply Current: 0.3-900uA; Resolution: 16bits; Min Supply Voltage: 1.62V; Max Supply Voltage: 3.6V; Category: IC; Device Class L3: unset; ComponentLink2URL: https://www.sensirion.com/fileadmin/user_upload/customers/sensirion/Dokumente/0_Datasheets/Humidity/Sensirion_Humidity_Sensors_SHTC3_Datasheet.pdf; Ipc Land Pattern Name: DFN200X200X75-4; RoHS: TRUE; Height: 0.75mm; Interface: I2C; Temperature Range High: +125°C; Accuracy: 2%; Sensor Output: I2C; Automotive: No; Package: 0; Device Class L1: Sensors; Manufacturer Part Number: SHTC3; Digikey Description: SENSOR HUMI/TEMP I2C 2% SMD; Lead Free: Yes; Temperature: -40°C to +125°C; Device Class L2: Temperature and Humidity Sensors; ComponentLink2Description: Datasheet; Octopart: https://octopart.com/shtc3-sensirion-91912225; Mouser Description: SHTC3 Series 0 to 100% RH 3.6 V Humidity and Temperature Sensor IC - DFN-4; Temperature Range Low: -40°C

## Sheet Actuators.SchDoc: Smart Street Light System - Actuators Schematic Doc
size 431 x 279 mm; Author: Arvind Balaji Narayan, Gopik Anand; CompanyName: Cats_and_Dogs; Engineer: Arvind Balaji Narayan, Gopik Anand; Organization: University of Pennsylvania
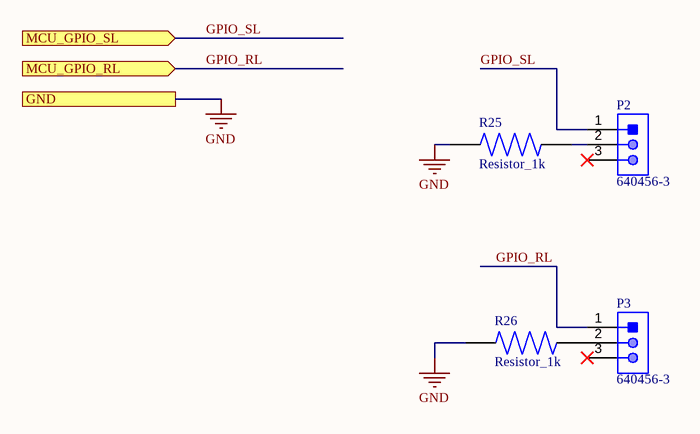
[diagram p10: Actuators.SchDoc]

### Parts
P2  640456-3  [TECO-640456-3]
P3  640456-3  [TECO-640456-3]
R25  Resistor_1k  [Resistor_1k]
R26  Resistor_1k  [Resistor_1k]

### Ports
GND, MCU_GPIO_RL (in), MCU_GPIO_SL (in)

### Nets
GND: R25.1 R26.1 ; port GND
GPIO_RL: P3.1 ; port MCU_GPIO_RL  [project net GPIO_o/p_Red]
GPIO_SL: P2.1 ; port MCU_GPIO_SL  [project net GPIO_o/p_Green]
NetP2_2: P2.2 R25.2
NetP3_2: P3.2 R26.2

Not connected (* = marked no-connect by the designer): P2 3*; P3 3*

### Notes on the sheet
- DWG. NO.
- REV.
- SHT.
- THIS DOCUMENT AND THE DATA DISCLOSED HEREIN OR HEREWITH IS THE PROPERTY OF ALTIUM LIMITED AND MAY BE FREELY DISTRIBUTED IN WHOLE. NO RIGHTS ARE RESERVED OR EXPRESS OR IMPLIED WARANTEE GIVEN.
- REVISION
- DESCRIPTION
- DATE
- APPROVED
- ENG:
- APPROVALS
- PROJECT
- DSN:
- CHK:
- REFERENCE DOCUMENTS
- PROJECT REVISION:
- TITLE
- DOCUMENT REVISION:
- DESIGN ITEM:
- BOM:
- FAB DWG:
- PCB DWG:
- ASSY DWG:
- SCALE:
- SIZE
- B
- CAGE CODE
- FILE NAME
- DWG NO.
- SHEET
- OF
- REV

### Library data of the parts
P2 P3 = CMP-2000-05418-1: as P6 on sheet PIR_Motion_Sensor; Manufacturer URL: http://www.te.com/; Datasheet URL: https://datasheet.ciiva.com/16456/eng-ds-82056-mta-0608-16456886.pdf; Flammability Rating: UL94V-0; Mounting Type: PCMount; Contact Mating Area Plating: Tin; Datasheet Version: Jun-08; Number of Rows: 1; Termination: Solder; Type: PCBPlug; Length, Pin: 0.14 / "; Color: White; Contact Plating: Tin; Contact Shape: Square; Number of Contacts: 3; Size, Post: 0.025 / in.; Length, Terminal Post: 0.14 / in.; Length, Overall: 0.3 / "
R25 R26 = Resistor_1k: Res Thick Film 0603 1K Ohm 1% 0.1W(1/10W) ±100ppm/C Pad SMD Automotive T/R; Manufacturer: TE Connectivity; Manufacturer Part Number: 1-2176092-8; Resistance: 1kR; Tolerance: 0.1%; Power Rating: 250mW; Temperature Coefficient: 25ppm/°C; Voltage Rating: 150V; Number of Resistors: 1; Supplier 1: Digi-Key; Supplier Part Number 1: A110543CT-ND; RoHS: Yes; Category: Chip SMD Resistors; Stock 1: 9833; Pricing 1: 1=0.64000, 10=0.47400, 100=0.27590 (USD); Mount: Surface Mount; Case/Package: 0805; Case Code (Metric): 2012; Case Code (Imperial): 0805; Min Operating Temperature: -55°C; Max Operating Temperature: 155°C; Packaging: Tape and Reel; Resistor Type: Thin Film; Termination: Solder; Package Quantity: 1000; Number of Terminations: 2; Max Power Dissipation: 250mW; Length: 0.079inch; Width: 0.049inch; Height: 0.026inch; RoHS Compliant: Yes; Lead Free: Lead Free; ComponentLink1URL: https://datasheet.ciiva.com/41821/eng-ds-1773272-j-41821837.pdf?src-supplier=Digi-Key; ComponentLink1Description: https://datasheet.ciiva.com/41821/eng-ds-1773272-j-41821837.pdf?src-supplier=Digi-Key; ComponentLink2URL: https://datasheet.ciiva.com/41823/eng-ds-1773272-j-41823324.pdf?src-supplier=Digi-Key; ComponentLink2Description: https://datasheet.ciiva.com/41823/eng-ds-1773272-j-41823324.pdf?src-supplier=Digi-Key; ComponentLink3URL: https://datasheet.ciiva.com/41808/eng-ds-1773272-j-41808533.pdf?src-supplier=Digi-Key; ComponentLink3Description: https://datasheet.ciiva.com/41808/eng-ds-1773272-j-41808533.pdf?src-supplier=Digi-Key; Supplier 2: Digi-Key; Supplier Part Number 2: RMCF0603FT1K00CT-ND; Stock 2: 2; Pricing 2: 1=0.10000, 10=0.01700, 100=0.00680, 1000=0.00305, 2500=0.00264 (USD); Contact Plating: Tin,Matte; Size Code: 0603; Features: Automotive AEC-Q200; Series: RMCF; Construction: Rectangular; Depth: 0.8mm; Radiation Hardening: No; Military Standard: Not; ComponentLink4URL: https://www.seielect.com/catalog/sei-rmcf_rmcp.pdf?src-supplier=Digi-Key; ComponentLink4Description: https://www.seielect.com/catalog/sei-rmcf_rmcp.pdf?src-supplier=Digi-Key; ComponentLink5URL: https://www.seielect.com/catalog/SEI-RMCF_RMCP.pdf?src-supplier=Avnet; ComponentLink5Description: https://www.seielect.com/catalog/SEI-RMCF_RMCP.pdf?src-supplier=Avnet; ComponentLink6URL: https://www.seielect.com/catalog/SEI-Packaging.pdf?src-supplier=Avnet; ComponentLink6Description: https://www.seielect.com/catalog/SEI-Packaging.pdf?src-supplier=Avnet; ComponentLink7URL: https://www.seielect.com/catalog/SEI-Packaging.pdf?src-supplier=Arrow+Electronics; ComponentLink7Description: https://www.seielect.com/catalog/SEI-Packaging.pdf?src-supplier=Arrow+Electronics; ComponentLink8URL: https://www.seielect.com/catalog/SEI-RMCF_RMCP.pdf?src-supplier=Avnet+Asia; ComponentLink8Description: https://www.seielect.com/catalog/SEI-RMCF_RMCP.pdf?src-supplier=Avnet+Asia; ComponentLink9URL: http://www.seielect.com/Catalog/SEI-rmc.pdf?src-supplier=Future+Electronics; ComponentLink9Description: http://www.seielect.com/Catalog/SEI-rmc.pdf?src-supplier=Future+Electronics; ComponentLink10URL: https://www.seielect.com/catalog/SEI-Packaging.pdf?src-supplier=Verical; ComponentLink10Description: https://www.seielect.com/catalog/SEI-Packaging.pdf?src-supplier=Verical; ComponentLink11URL: https://www.seielect.com/catalog/SEI-Packaging.pdf?src-supplier=Quest; ComponentLink11Description: https://www.seielect.com/catalog/SEI-Packaging.pdf?src-supplier=Quest